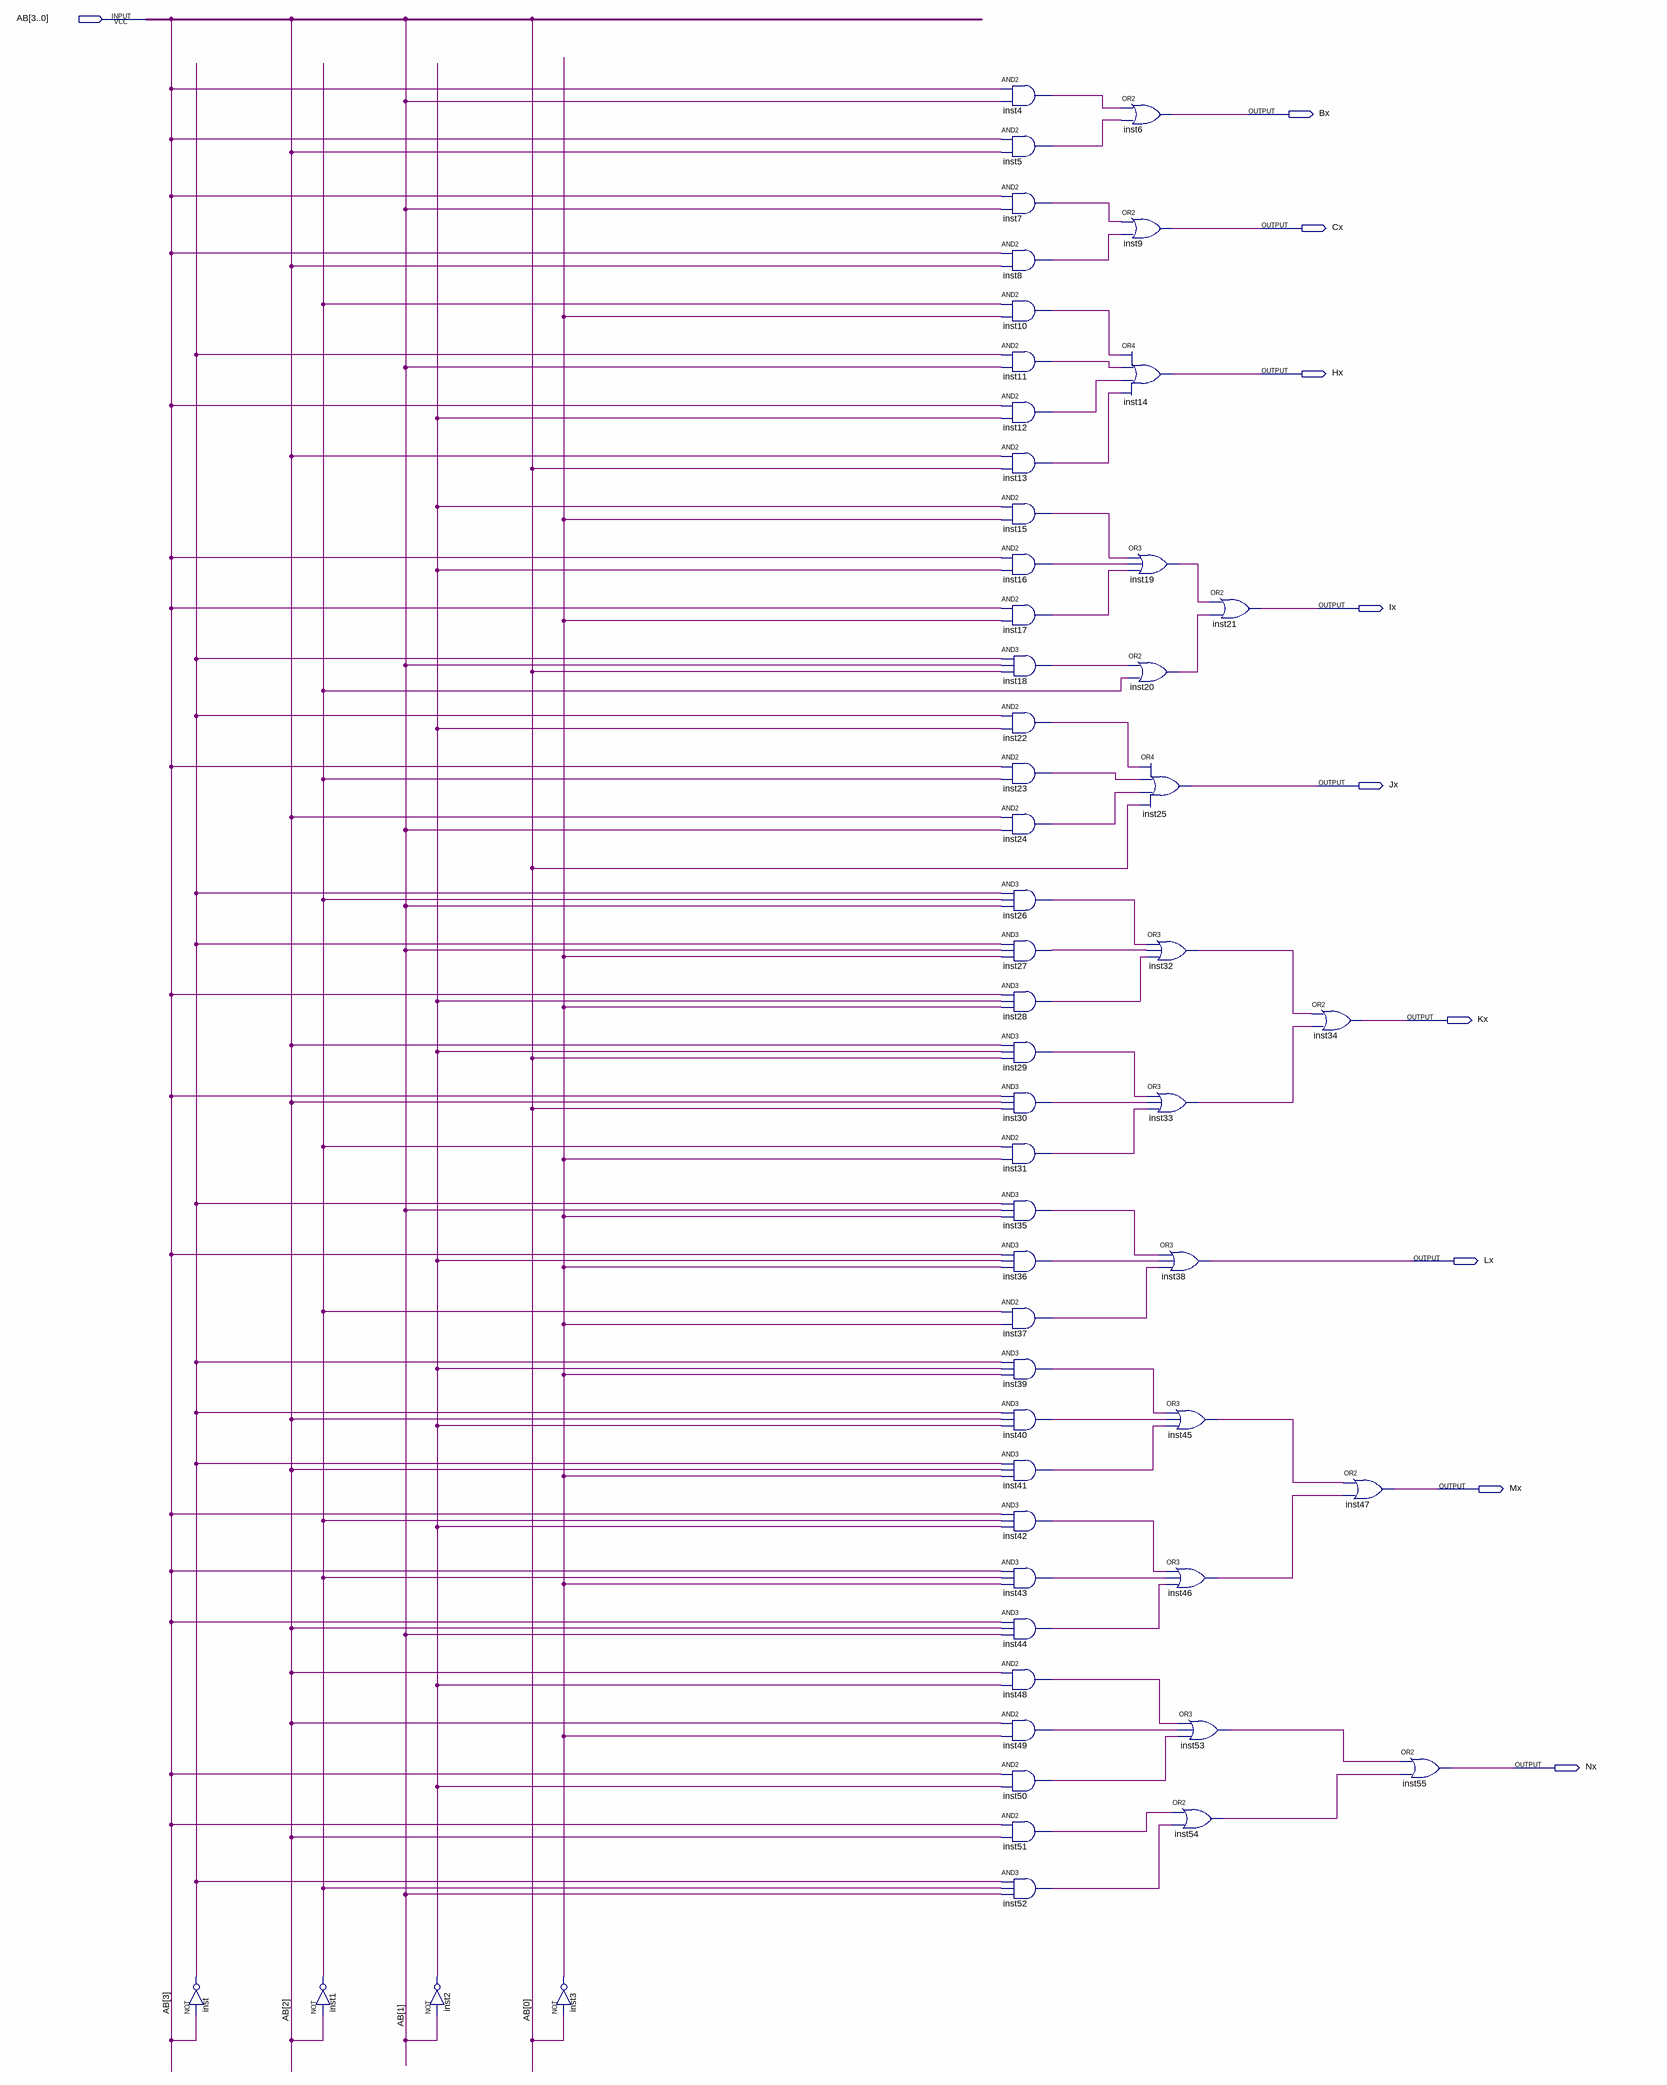
[diagram p0: schematic sheet]
// Quartus schematic DecodificadorAB.bdf as structural Verilog: 56 symbols, 10 pins
module DecodificadorAB (
  input  [3:0] AB,
  output Bx,
  output Cx,
  output Hx,
  output Ix,
  output Jx,
  output Kx,
  output Lx,
  output Mx,
  output Nx
);

  wire inst1_out, inst2_out, inst3_out, inst4_out, inst5_out, inst7_out, inst8_out, inst10_out, inst11_out,
       inst12_out, inst13_out, inst15_out, inst16_out, inst17_out, inst18_out, inst19_out, inst20_out,
       inst22_out, inst23_out, inst24_out, inst26_out, inst27_out, inst28_out, inst29_out, inst30_out,
       inst31_out, inst32_out, inst33_out, inst35_out, inst36_out, inst37_out, inst39_out, inst40_out,
       inst41_out, inst42_out, inst43_out, inst44_out, inst45_out, inst46_out, inst48_out, inst49_out,
       inst50_out, inst51_out, inst52_out, inst53_out, inst54_out, inst_out;

  not inst (inst_out, AB[3]);
  not inst1 (inst1_out, AB[2]);
  not inst2 (inst2_out, AB[1]);
  not inst3 (inst3_out, AB[0]);
  and inst4 (inst4_out, AB[3], AB[1]);
  and inst5 (inst5_out, AB[3], AB[2]);
  and inst7 (inst7_out, AB[3], AB[1]);
  and inst8 (inst8_out, AB[3], AB[2]);
  and inst10 (inst10_out, inst1_out, inst3_out);
  and inst11 (inst11_out, inst_out, AB[1]);
  and inst12 (inst12_out, AB[3], inst2_out);
  and inst13 (inst13_out, AB[2], AB[0]);
  and inst15 (inst15_out, inst2_out, inst3_out);
  and inst16 (inst16_out, AB[3], inst2_out);
  and inst17 (inst17_out, AB[3], inst3_out);
  and inst18 (inst18_out, inst_out, AB[1], AB[0]);
  and inst22 (inst22_out, inst_out, inst2_out);
  and inst23 (inst23_out, AB[3], inst1_out);
  and inst24 (inst24_out, AB[2], AB[1]);
  and inst26 (inst26_out, inst_out, inst1_out, AB[1]);
  and inst27 (inst27_out, inst_out, AB[1], inst3_out);
  and inst28 (inst28_out, AB[3], inst2_out, inst3_out);
  and inst29 (inst29_out, AB[2], inst2_out, AB[0]);
  and inst30 (inst30_out, AB[3], AB[2], AB[0]);
  and inst31 (inst31_out, inst1_out, inst3_out);
  and inst35 (inst35_out, inst_out, AB[1], inst3_out);
  and inst36 (inst36_out, AB[3], inst2_out, inst3_out);
  and inst37 (inst37_out, inst1_out, inst3_out);
  and inst39 (inst39_out, inst_out, inst2_out, inst3_out);
  and inst40 (inst40_out, inst_out, AB[2], inst2_out);
  and inst41 (inst41_out, inst_out, AB[2], inst3_out);
  and inst42 (inst42_out, AB[3], inst1_out, inst2_out);
  and inst43 (inst43_out, AB[3], inst1_out, inst3_out);
  and inst44 (inst44_out, AB[3], AB[2], AB[1]);
  and inst48 (inst48_out, AB[2], inst2_out);
  and inst49 (inst49_out, AB[2], inst3_out);
  and inst50 (inst50_out, AB[3], inst2_out);
  and inst51 (inst51_out, AB[3], AB[2]);
  and inst52 (inst52_out, inst_out, inst1_out, AB[1]);
  or inst6 (Bx, inst4_out, inst5_out);
  or inst9 (Cx, inst7_out, inst8_out);
  or inst14 (Hx, inst10_out, inst11_out, inst12_out, inst13_out);
  or inst19 (inst19_out, inst15_out, inst16_out, inst17_out);
  or inst20 (inst20_out, inst18_out, inst1_out);
  or inst25 (Jx, inst22_out, inst23_out, inst24_out, AB[0]);
  or inst32 (inst32_out, inst26_out, inst27_out, inst28_out);
  or inst33 (inst33_out, inst29_out, inst30_out, inst31_out);
  or inst38 (Lx, inst35_out, inst36_out, inst37_out);
  or inst45 (inst45_out, inst39_out, inst40_out, inst41_out);
  or inst46 (inst46_out, inst42_out, inst43_out, inst44_out);
  or inst21 (Ix, inst19_out, inst20_out);
  or inst53 (inst53_out, inst48_out, inst49_out, inst50_out);
  or inst54 (inst54_out, inst51_out, inst52_out);
  or inst34 (Kx, inst32_out, inst33_out);
  or inst47 (Mx, inst45_out, inst46_out);
  or inst55 (Nx, inst53_out, inst54_out);
endmodule
